# EAGLE design 2x18650Holder (EAGLE 8.2.2)
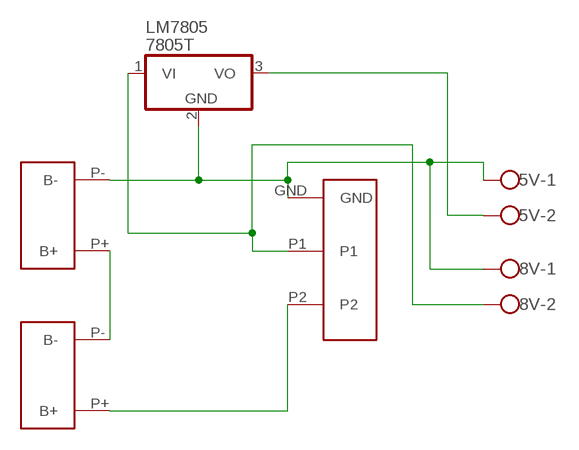
[diagram p0: schematic, sheet 1]

## Parts
5V  SCREWCONNECTOR  [2PIN-SCREW-TERMINAL]
8V  SCREWCONNECTOR  [2PIN-SCREW-TERMINAL]
LM7805  7805T  [TO220H]
U$1  BATTERY  [BATTERY]
U$2  BATTERY  [BATTERY]
U$3  ROCKER  [ROCKER]

## Nets
GND: 5V.1 8V.1 LM7805.2(GND) U$2.P-(B-) U$3.GND
N$2: 5V.2 LM7805.3(VO)
N$3: 8V.2 LM7805.1(VI) U$3.P1
N$4: U$1.P-(B-) U$2.P+(B+)
N$5: U$1.P+(B+) U$3.P2

## Library data of the parts
5V 8V = ISCTRainingProgram:SCREWCONNECTOR: WAGO SCREW CLAMP; MPN: 237-102; OC_FARNELL: unknown; OC_NEWARK: 70K9898
LM7805 = adafruit:78*: Positive VOLTAGE REGULATOR Added bigger pads to the TO-92 package
U$1 U$2 = ISCTRainingProgram:BATTERY
U$3 = ISCTRainingProgram:ROCKER

## Board
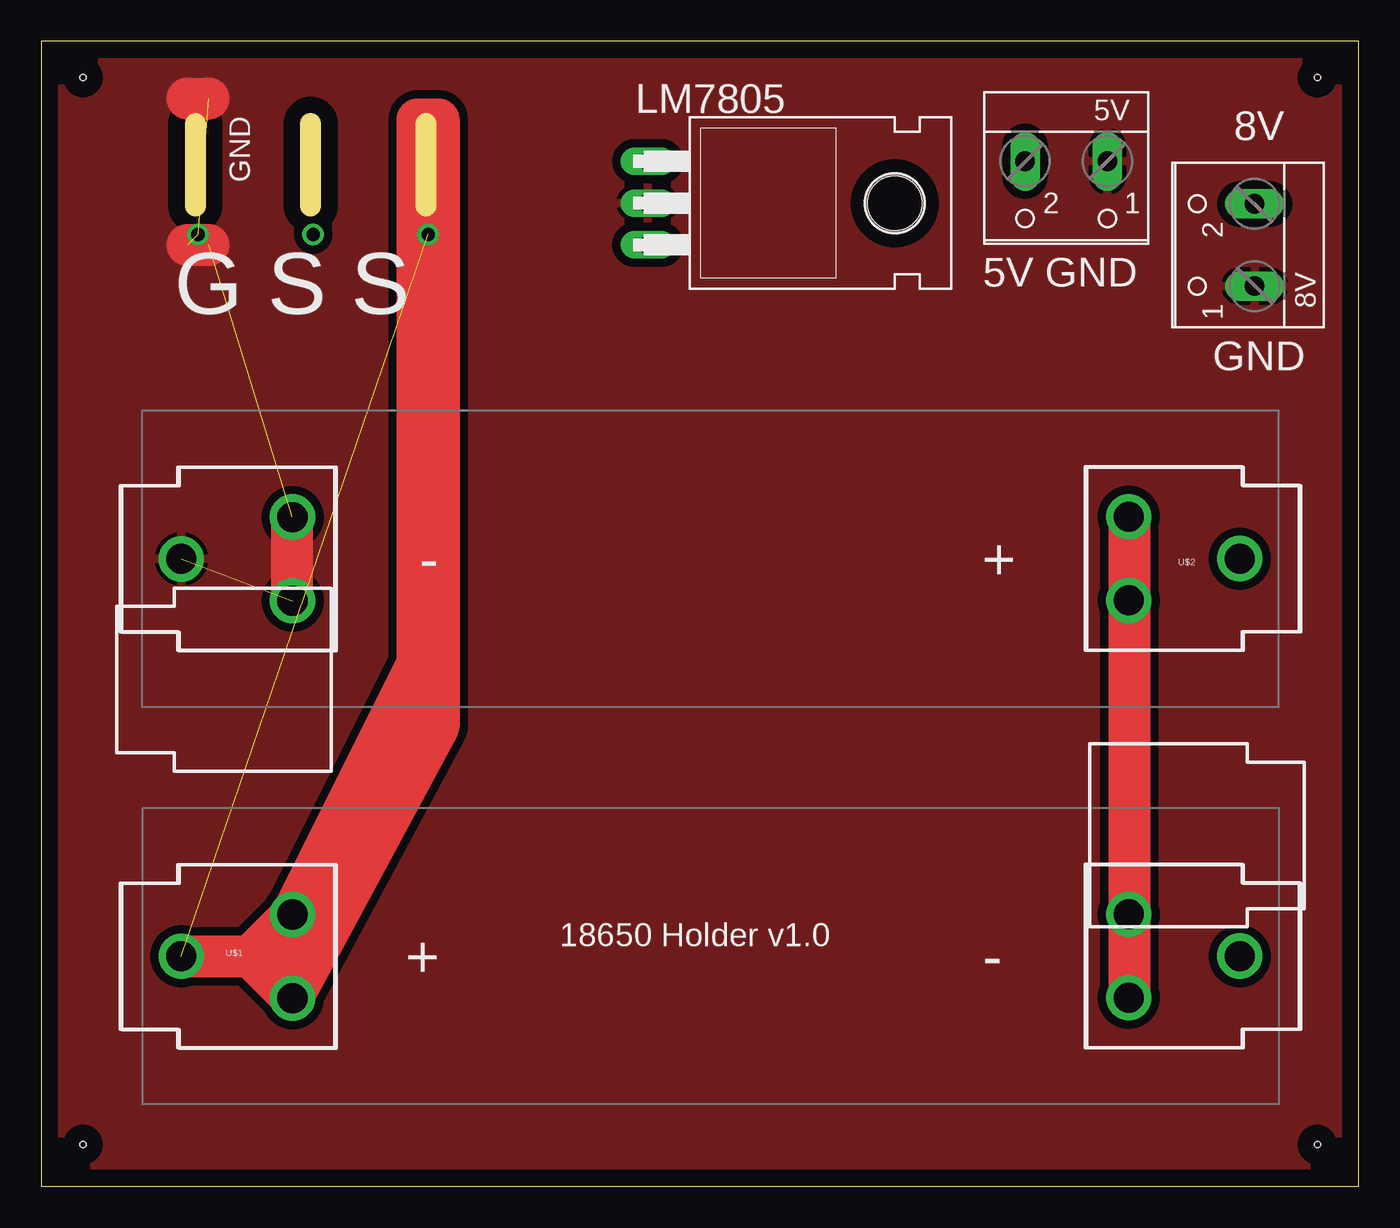
[diagram p1: board, top side]
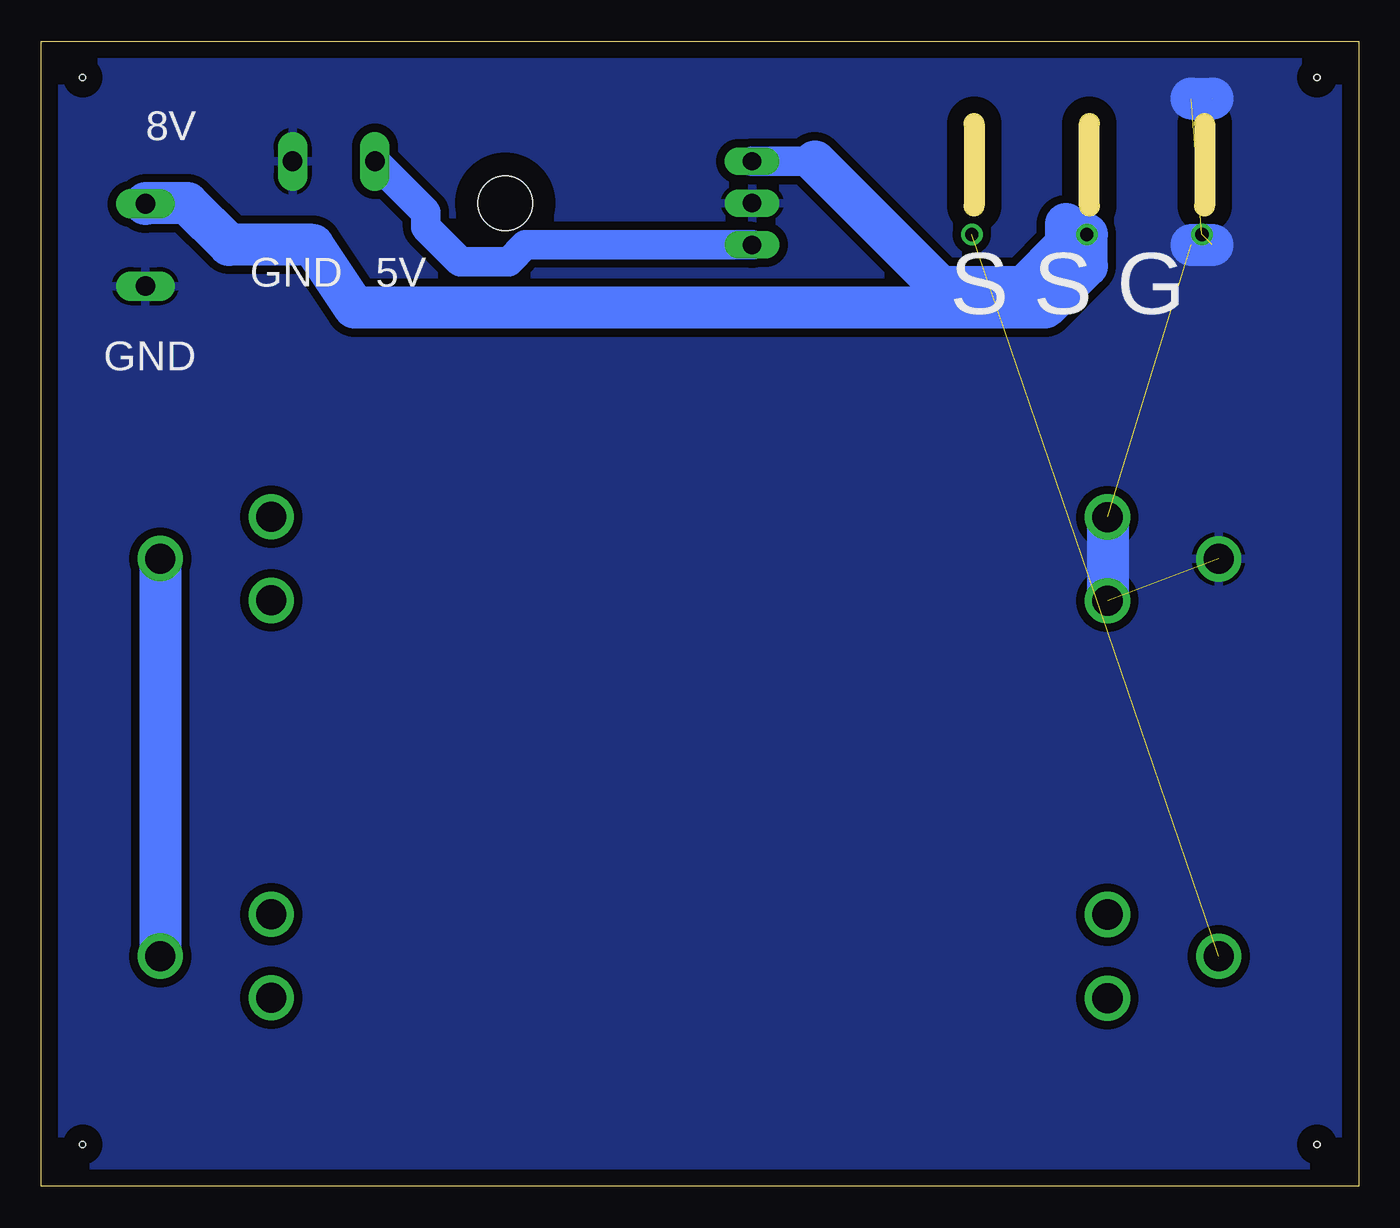
[diagram p2: board, bottom side, seen from below]

Size 79.99 x 69.52 mm. Coordinates in mm from the lower left corner, seen from the top.
Outline: 0,0 79.99,0 79.99,69.52 0,69.52 0,0
Copper layers (1*16): Top 0.035mm / dielectric 1.5mm / Bottom 0.035mm
Design rules "default": minimum track width 6mil, minimum drill 0.35mm, track to track 6mil, track to pad 6mil, pad to pad 6mil, via to via 6mil, smd to smd 6mil, copper to edge 40mil, drill to drill 6mil, minimum pad ring 10mil, minimum via ring 8mil, stop-mask expansion 4mil, vias tented up to drill 0mil, thermal gap 10mil
Holes 0.35 mm at 2.54,2.54 77.47,2.54 77.47,67.31 2.54,67.31

### Footprints (pad centres in the part's own frame; a part is rotated, then mirrored left to right if it is on the bottom)
2PIN-SCREW-TERMINAL = drill 1.194 long: 1 -2.5,-1.27; 2 2.5,-1.27
TO220H = drill 1.118 long: 1 -2.54,-10.16; 2 0,-10.16; 3 2.54,-10.16 | hole 3.302: 0,4.826
BATTERY = drill 1.829: GND@2 27.92,5.09; GND@3 27.92,0.01; P+ -29.588,2.53; P- 34.668,2.55; PWR@2 -22.84,5.07; PWR@3 -22.84,-0.01
ROCKER = drill 0.8: GND -4.445,6.985; P1 -4.445,0; P2 -4.445,-6.985

### Placement (x,y rotation side)
5V  62.23,60.96 180 top
8V  72.39,57.15 90 top
LM7805  46.99,59.69 270 top
U$1  38.1,11.43 0 top
U$2  43.18,40.64 180 top
U$3  16.51,62.23 90 top

### Tracks (layer width: path | path; a pad name or v marks a point on that pad's centre or on a via)
GND  (7 unrouted)
  Top 2.54: 15.24,35.56 15.24,40.64 | 8.89,57.15 10.16,57.15 | 8.89,66.04 10.16,66.04
  Bottom 2.54: 15.24,40.64 15.24,35.56 | 10.16,57.15 8.89,57.15 | 10.16,66.04 8.89,66.04
  pour Bottom (isolate 0.508): 0,0 80.01,0 80.01,69.85 0,69.85
  pour Top (isolate 0.508): 0,0 80.01,0 80.01,69.85 0,69.85
N$2
  Bottom 1.778: LM7805.3 50.6,57.15 51.61,56.13 54.56,56.13 56.64,58.22 56.64,59.14 5V.2
N$3
  Bottom 1.778: LM7805.1 33.02,62.23
  Bottom 2.54: 33.02,62.23 25.4,54.61 20.32,54.61 17.78,57.15 17.78,58.42 17.14,57.78 U$3.P1 16.51,55.88 19.05,53.34 60.96,53.34 63.5,57.15 68.58,57.15 71.12,59.69 73.62,59.69 8V.2
N$4
  Bottom 2.54: U$2.P+ U$1.P-
N$5  (1 unrouted)
N$6
  Top 2.54: 8.89,13.97 12.7,13.97 | 12.7,13.97 15.24,16.51 | 15.24,16.51 15.24,11.43 | 12.7,13.97 15.24,11.43 | 15.24,11.43 22.86,29.21 22.86,31.75 | 22.86,31.75 22.86,64.77 24.13,64.77 24.13,27.94 15.24,11.43 | 15.24,16.51 22.86,31.75
N$7
  Top 2.54: 66.04,40.64 66.04,11.43

### Text on the board
tNames: 8V | 5V GND | G S S | GND | 18650 Holder v1.0
bNames: 8V | 5V | GND | S S G | GND